# EAGLE schematic Battery Board V3 (EAGLE 7.6.0)
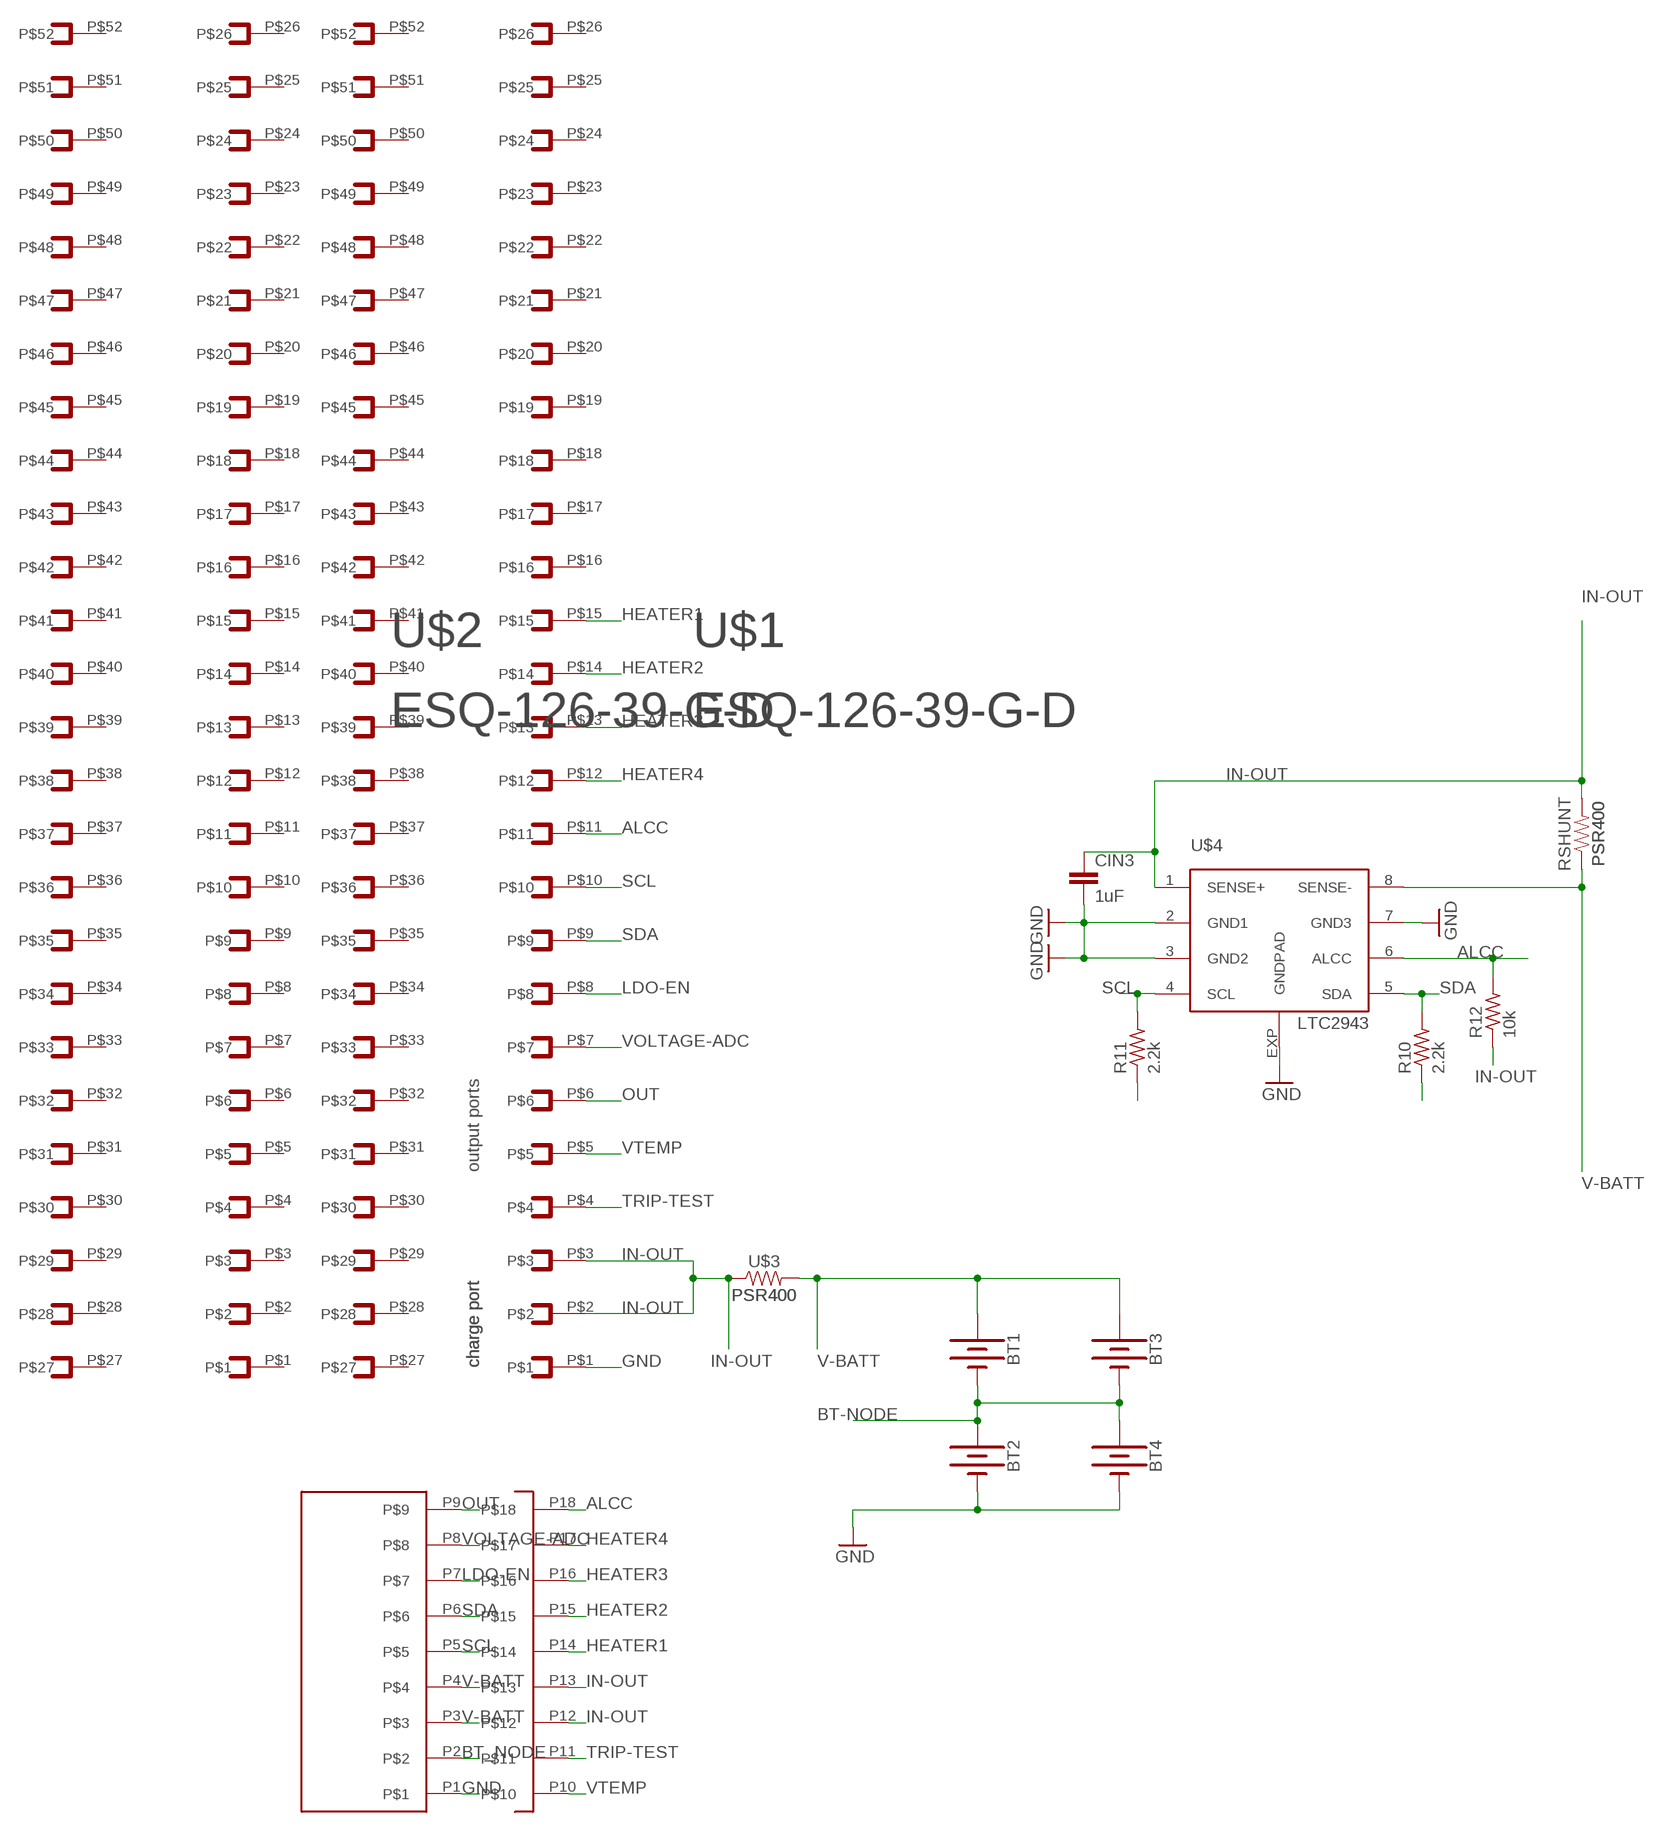
[diagram p0: schematic, sheet 1]

## Parts
BT1  BATTERY-18650  [BATTERY_18650-HOLDER]
BT2  BATTERY-18650  [BATTERY_18650-HOLDER]
BT3  BATTERY-18650  [BATTERY_18650-HOLDER]
BT4  BATTERY-18650  [BATTERY_18650-HOLDER]
CIN3  1uF  .1UF-CER  [0402-CAP]
R10  2.2k  R-US_R0805  [R0805]
R11  2.2k  R-US_R0805  [R0805]
R12  10k  R-US_R0805  [R0805]
RSHUNT  PSR400  [PSR400]
U$1  ESQ-126-39-G-D  [(RD)ESQ-126-39-G-D]
U$2  ESQ-126-39-G-D  [(RD)ESQ-126-39-G-D]
U$3  PSR400  [PSR400]
U$4  LTC2943  [DFN8(3X3)LT]
U$7  FFC18  [FFC18]

## Nets
ALCC: R12.2 U$1.P$11 U$4.6(ALCC) U$7.P18
BT-NODE: BT1.GND@1(-) BT2.PWR@1(+) BT3.GND@1(-) BT4.PWR@1(+)
BT_NODE: U$7.P2
GND: BT2.GND@1(-) BT4.GND@1(-) CIN3.2 U$1.P$1 U$4.2(GND1) U$4.3(GND2) U$4.7(GND3) U$4.EXP(GNDPAD) U$7.P1
HEATER1: U$1.P$15 U$7.P14
HEATER2: U$1.P$14 U$7.P15
HEATER3: U$1.P$13 U$7.P16
HEATER4: U$1.P$12 U$7.P17
IN-OUT: CIN3.1 R10.1 R11.1 R12.1 RSHUNT.P$2 U$1.P$2 U$1.P$3 U$3.P$1 U$4.1(SENSE+) U$7.P12 U$7.P13
LDO-EN: U$1.P$8 U$7.P7
OUT: U$1.P$6 U$7.P9
SCL: R11.2 U$1.P$10 U$4.4(SCL) U$7.P5
SDA: R10.2 U$1.P$9 U$4.5(SDA) U$7.P6
TRIP-TEST: U$1.P$4 U$7.P11
V-BATT: BT1.PWR@1(+) BT3.PWR@1(+) RSHUNT.P$1 U$3.P$2 U$4.8(SENSE-) U$7.P3 U$7.P4
VOLTAGE-ADC: U$1.P$7 U$7.P8
VTEMP: U$1.P$5 U$7.P10
Unconnected: U$1.P$16 U$1.P$17 U$1.P$18 U$1.P$19 U$1.P$20 U$1.P$21 U$1.P$22 U$1.P$23 U$1.P$24 U$1.P$25 U$1.P$26 U$1.P$27 U$1.P$28 U$1.P$29 U$1.P$30 U$1.P$31 U$1.P$32 U$1.P$33 U$1.P$34 U$1.P$35 U$1.P$36 U$1.P$37 U$1.P$38 U$1.P$39 U$1.P$40 U$1.P$41 U$1.P$42 U$1.P$43 U$1.P$44 U$1.P$45 U$1.P$46 U$1.P$47 U$1.P$48 U$1.P$49 U$1.P$50 U$1.P$51 U$1.P$52 U$2.P$1 U$2.P$2 U$2.P$3 U$2.P$4 U$2.P$5 U$2.P$6 U$2.P$7 U$2.P$8 U$2.P$9 U$2.P$10 U$2.P$11 U$2.P$12 U$2.P$13 U$2.P$14 U$2.P$15 U$2.P$16 U$2.P$17 U$2.P$18 U$2.P$19 U$2.P$20 U$2.P$21 U$2.P$22 U$2.P$23 U$2.P$24 U$2.P$25 U$2.P$26 U$2.P$27 U$2.P$28 U$2.P$29 U$2.P$30 U$2.P$31 U$2.P$32 U$2.P$33 U$2.P$34 U$2.P$35 U$2.P$36 U$2.P$37 U$2.P$38 U$2.P$39 U$2.P$40 U$2.P$41 U$2.P$42 U$2.P$43 U$2.P$44 U$2.P$45 U$2.P$46 U$2.P$47 U$2.P$48 U$2.P$49 U$2.P$50 U$2.P$51 U$2.P$52

## Notes on the sheet
- output ports
- charge port | charge port

## Library data of the parts
BT1-BT4 = SparkFun-Batteries:BATTERY: Battery - Single Cell A variety of battery chemistries, sizes, and footprints. Device List: 20MM_PTH - Coin Cell Battery Holder - 20mm (PTH) <https://www.sparkfun.com/products/783> 12MM_SMD - Coin Cell Battery Holder - 12mm (SMD) <https://www.sparkfun.com/products/10592> 12MM_PTH - Coin Cell Battery Holder - 12mm (PTH) <https://www.sparkfun.com/products/7948> 20MM_SMD - 20mm Coin Cell Battery Holder (SMD) (2 legs) Used on the Big Time Watch Kit <https://www.sparkfun.com/products/11734> 20MM_SMD_4LEGS - Coin Cell Battery Holder - 20mm (SMD) <https://www.sparkfun.com/products/11892> 20MM_SMD_4LEGS_OVERPASTE - Coin Cell Battery Holder - 20mm (SMD) <https://www.sparkfun.com/products/11892> (Over-paste on the legs) 24.5MM_PTH - Coin Cell Battery Holder - 24.5mm (PTH) <https://www.sparkfun.com/products/8863> 9V - 9V Battery Holder - PC Mount Used on the SparkFun SparkPunk Sound Kit <https://www.sparkfun.com/products/11177> and SparkFun SparkPunk Sequencer Kit <https://www.sparkfun.com/products/12707> 18650 - Battery Holder - 18650 (PTH) <https://www.sparkfun.com/products/13113> AA - Battery Holder - 1xAA (PTH) <https://www.sparkfun.com/products/7949> AAA - Battery Holder - 1xAAA (PTH) <https://www.sparkfun.com/products/12718> AA_KIT - Battery Holder - 1xAA (PTH) <https://www.sparkfun.com/products/7949> Special kit package - pads only have exposed copper on one side of the board. AAA_KIT - Battery Holder - 1xAAA (PTH) <https://www.sparkfun.com/products/12718> Special kit package - pads only have exposed copper on one side of the board.; PROD_ID: BATT-12327; SF_SKU: PRT-13113
CIN3 = SparkFun-Retired:.1UF-CER: .1uF ceramic SMT CAP-00810- 25V +80%/-20% (0603) CAP-08390- 100V 10% (0603) CAP-08604- 25V 5% (0603); PROD_ID: CAP-00810; VALUE: 0.1uF
R10-R12 = rcl:R-US_: RESISTOR, American symbol
RSHUNT U$3 = Parts for Power Team1:PSR400
U$1 U$2 = Parts for Power Team:ESQ-126-39-G-D
U$4 = Parts for Power Team:LTC2943
U$7 = Parts for Power Team1:FFC18